# Altium schematic sheet DSI_LCD.SchDoc: 4 inch DSI LCD board
size A4; Date: 9/24/2014; Author: P.A.; CompanyName: STMicroelectronics; Organization: Microcontrollers Division; Address1: 12, Rue Jules HOROWITZ; Address2: 38019 Grenoble; Address3: FRANCE; DocumentNumber: 8; Revision: B-07; SheetNumber: 8; SheetTotal: 13; Project: STM32F469I-DISCO
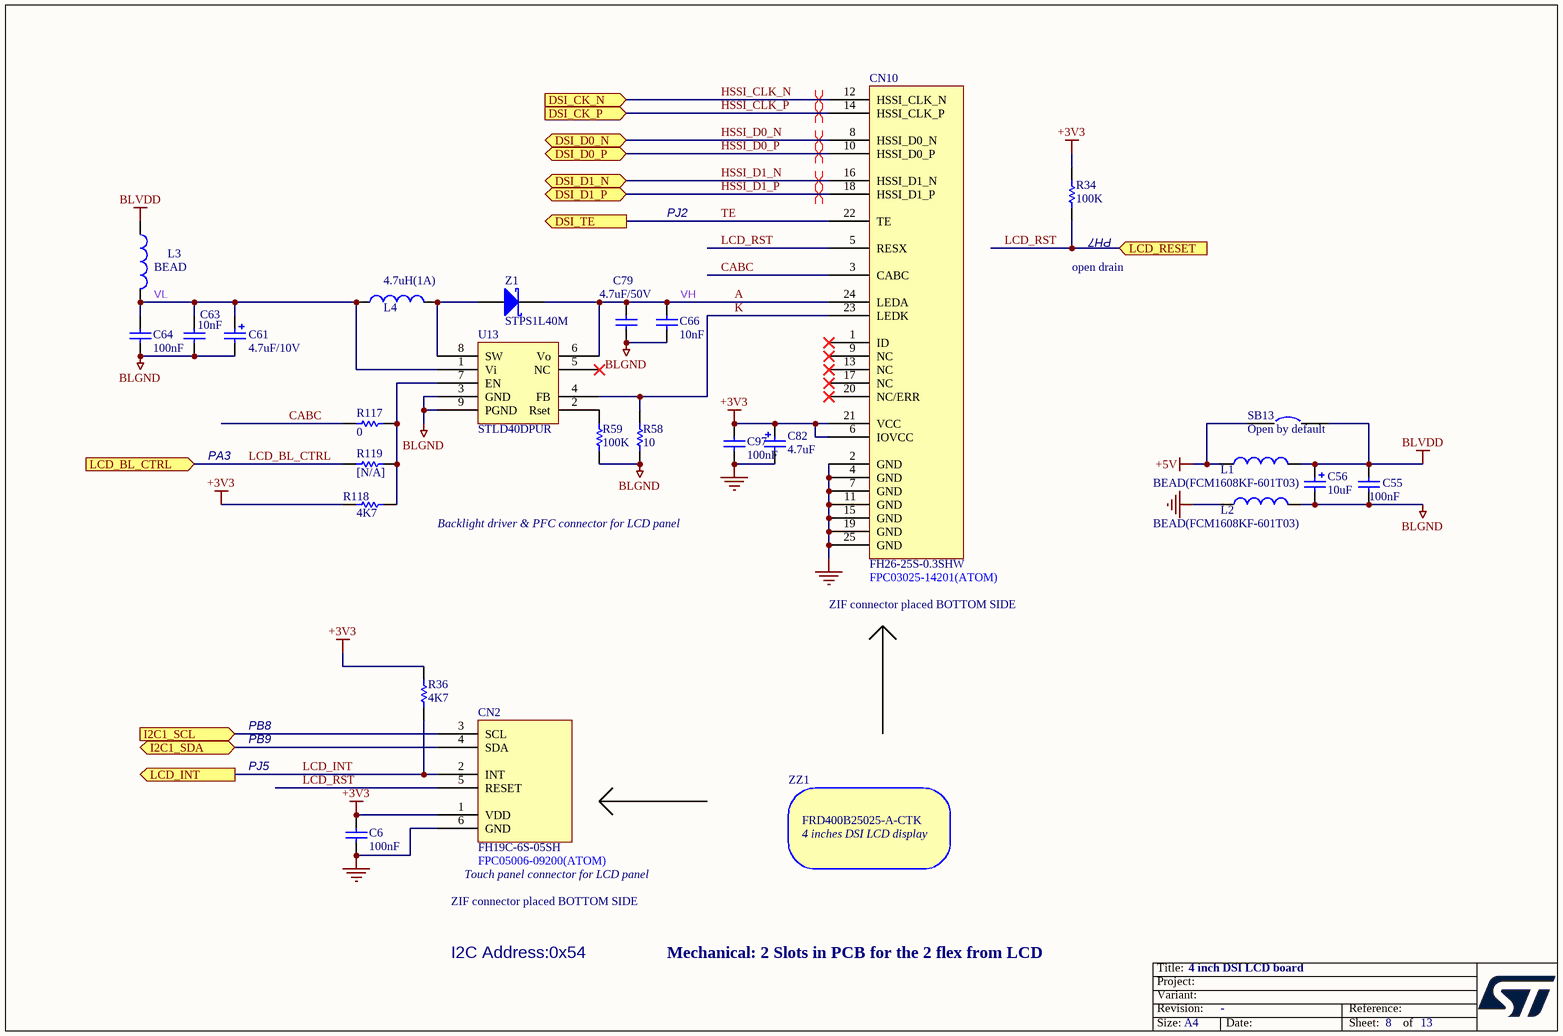
[diagram p0: DSI_LCD.SchDoc]

## Parts
C6  100nF  [0402C]
C55  100nF  [0402C]
C56  10uF  [TAN-A]
C61  4.7uF/10V  [1206C]
C63  10nF  [0603C]
C64  100nF  [0402C]
C66  10nF  [0603C]
C79  4.7uF/50V  [1206C]
C82  4.7uF  [TAN-A]
C97  100nF  [0402C]
CN2  FH19C-6S-05SH  [FH19C-6S-0R5SH_FPC_CPT]
CN10  FH26-25S-0.3SHW  [FPC25_FPC03025-1420]
L1  BEAD(FCM1608KF-601T03)  [0603L]
L2  BEAD(FCM1608KF-601T03)  [0603L]
L3  BEAD  [0603L]
L4  4.7uH(1A)  [1210L]
R34  100K  [0402R]
R36  4K7  [0603R]
R58  10  [0603R]
R59  100K  [0603R]
R117  0  [0603R]
R118  4K7  [0603R]
R119  [N/A]  [0603R]
SB13  Open by default  [SB_0603]
U13  STLD40DPUR  [SON8_0R65_3X3]
Z1  STPS1L40M  [DO-216AA]
ZZ1  FRD400B25025-A-CTK

## Ports
DSI_CK_N (in), DSI_CK_P (in), DSI_D0_N (bidir), DSI_D0_P (bidir), DSI_D1_N (bidir), DSI_D1_P (bidir), DSI_TE (out), I2C1_SCL (in), I2C1_SDA (bidir), LCD_BL_CTRL (in), LCD_INT (out), LCD_RESET (in)

## Nets
+3V3: C6.2 C82.1 C97.2 CN2.1(VDD) CN10.6(IOVCC) CN10.21(VCC) R34.1 R36.1 R118.2
+5V: L1.1 SB13.1
BLGND: C55.2 C56.2 C61.2 C63.1 C64.1 C66.1 C79.2 L2.2 R58.1 R59.2 U13.3(GND) U13.9(PGND)
BLVDD: C55.1 C56.1 L1.2 L3.1 SB13.2
GND: C6.1 C82.2 C97.1 CN2.6(GND) CN10.2(GND) CN10.4(GND) CN10.7(GND) CN10.11(GND) CN10.15(GND) CN10.19(GND) CN10.25(GND) L2.1
A: C66.2 C79.1 CN10.24(LEDA) U13.6(Vo) Z1.2(K)  [also labelled VH]
CABC: CN10.3(CABC) R117.2
HSSI_CLK_N: CN10.12(HSSI_CLK_N) ; port DSI_CK_N
HSSI_CLK_P: CN10.14(HSSI_CLK_P) ; port DSI_CK_P
HSSI_D0_N: CN10.8(HSSI_D0_N) ; port DSI_D0_N
HSSI_D0_P: CN10.10(HSSI_D0_P) ; port DSI_D0_P
HSSI_D1_N: CN10.16(HSSI_D1_N) ; port DSI_D1_N
HSSI_D1_P: CN10.18(HSSI_D1_P) ; port DSI_D1_P
I2C1_SCL: CN2.3(SCL) ; port I2C1_SCL
I2C1_SDA: CN2.4(SDA) ; port I2C1_SDA
K: CN10.23(LEDK) R58.2 U13.4(FB)
LCD_BL_CTRL: R119.2 ; port LCD_BL_CTRL
LCD_INT: CN2.2(INT) R36.2 ; port LCD_INT
LCD_RST: CN2.5(RESET) CN10.5(RESX) R34.2 ; port LCD_RESET
TE: CN10.22(TE) ; port DSI_TE
VL: C61.1 C63.2 C64.2 L3.2 L4.1 U13.1(Vi)
NetL4_2: L4.2 U13.8(SW) Z1.1(A)
NetR59_1: R59.1 U13.2(Rset)
NetR117_1: R117.1 R118.1 R119.1 U13.7(EN)

Not connected (* = marked no-connect by the designer): CN10 1(ID)* 9(NC)* 13(NC)* 17(NC)* 20(NC/ERR)*; U13 5(NC)*

## Layout directives
differential pair: HSSI_CLK_N, HSSI_CLK_P, HSSI_D0_N, HSSI_D0_P, HSSI_D1_N, HSSI_D1_P

## Notes on the sheet
- PJ2
- (near R34) PH7
- open drain
- PA3
- Backlight driver & PFC connector for LCD panel
- (near CN10) FPC03025-14201(ATOM)
- ZIF connector placed BOTTOM SIDE
- PB9
- PB8
- PJ5
- (near ZZ1) 4 inches DSI LCD display
- (near CN2) Touch panel connector for LCD panel
- (near CN2) FPC05006-09200(ATOM)
- I2C Address:0x54
- Mechanical: 2 Slots in PCB for the 2 flex from LCD
- Title:
- Project:
- Size:
- Revision:
- Variant:
- A4
- -
- Date:
- Reference:
- Sheet:
- of

## Library data of the parts
C6 C63 C64 C66 C79 C97 = CAP: Capacitor; Value: 100pF; Ordered by: Subcon; Published: 8-Jun-2000; Revision: July-2002: Re-released for DXP Platform.; Publisher: Altium Limited
C55 = Cap: Capacitor; Value: 10nF; Ordered by: Subcon; Published: 8-Jun-2000; Revision: July-2002: Re-released for DXP Platform.; Publisher: Altium Limited
C56 = Cap Pol1: Polarized Capacitor (Radial); Ordered by: Subcon; Published: 8-Jun-2000; Revision: July-2002: Re-released for DXP Platform.; Publisher: Altium Limited; Value: 10uF
C61 C82 = Cap Pol1: Polarized Capacitor (Radial); Value: 100pF; Ordered by: Subcon; Published: 8-Jun-2000; Revision: July-2002: Re-released for DXP Platform.; Publisher: Altium Limited
CN2 = FH19C-6S-05SH: ZIF connector placed bottom side; Manuf_1: ATOM; Manuf_2: Hirose; Manuf_Part_1: FPC05006-09200; Ordered by: Subcon; Silkscreen: TS; Manuf_Part_2: FH19C-6S-05SH
CN10 = FH26-25S-0.3SHW: ZIF connector placed bottom side; Manuf_1: ATOM; Manuf_Part_1: FPC03025-14201; Manuf_2: Hirose; Ordered by: Subcon; Comments: Hirose FH26-25S-0.3SHW; Silkscreen: DSI LCD; Manuf_Part_2: FH26-25S-0.3SHW
L1-L4 = Inductor: Value: 100uH; Ordered by: Subcon; Published: 8-Jun-2000; Revision: July-2002: Re-released for DXP Platform.; Publisher: Altium Limited
R34 R36 R58 R59 R117 R118 = Res1: Resistor; Value: 1K; Ordered by: Subcon; Published: 8-Jun-2000; Revision: July-2002: Re-released for DXP Platform.; Publisher: Altium Limited
R119 = Res1: Resistor; Value: 1K; Ordered by: Subcon; Fitted: NO; Published: 8-Jun-2000; Revision: July-2002: Re-released for DXP Platform.; Publisher: Altium Limited
SB13 = Circuit Breaker: Ordered by: Subcon; Comments: Solder bridge; Fitted: NO; Published: 24-Mar-1999; Revision: July-2002: Re-released for DXP Platform.; Publisher: Altium Limited
U13 = STLD40DPMR: Ordered by: ST; Ref St: 9176009; ECCN_US/EU: EAR99/NEC; Manuf_1: ST; Manuf_Part_1: STLD40DPUR
Z1 = D Schottky: Schottky Diode; Code - JEDEC: DO-214-AA; Ordered by: ST; Ref St: 9151085; ECCN_US/EU: EAR99/NEC; Published: 8-Jun-2000; Revision: July-2002: Re-released for DXP Platform.; Publisher: Altium Limited; Manuf_1: ST; Manuf_Part_1: STPS1L40M
ZZ1 = BoM_Item: 4 inches DSI LCD with touch screen; Manuf_1: Frida; Ordered by: Subcon; Comments: 4 inches DSI LCD display; ECCN_US/EU: EAR99/NEC; Manuf_Part_1: FRD400B25025-A-CTK